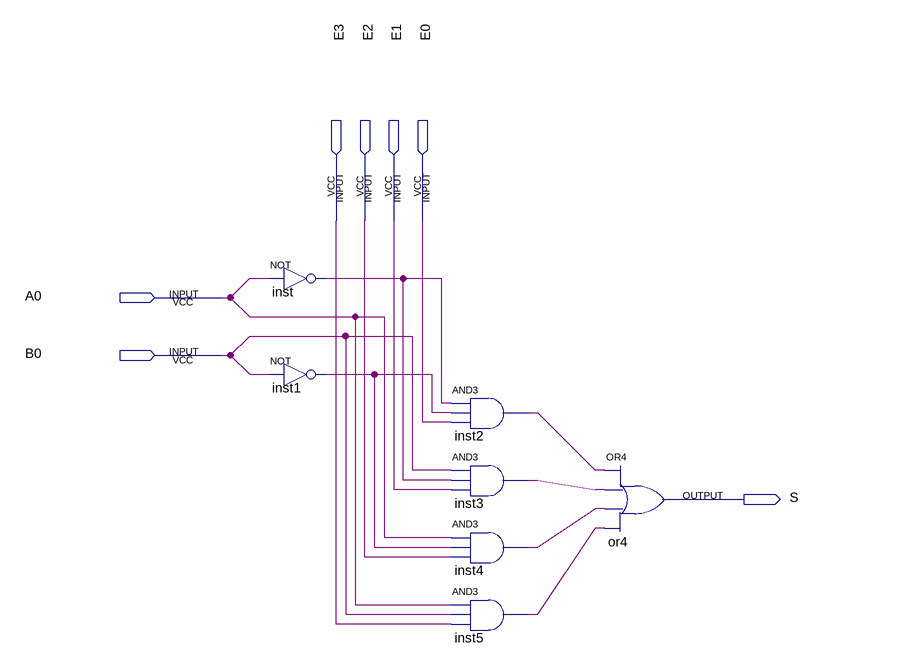
[diagram p0: schematic sheet]
// Quartus schematic mux_41.bdf as structural Verilog: 7 symbols, 7 pins
module mux_41 (
  input  E3,
  input  E2,
  input  E1,
  input  E0,
  input  A0,
  input  B0,
  output S
);

  wire inst1_out, inst2_out, inst3_out, inst4_out, inst5_out, inst_out;

  not inst (inst_out, A0);
  not inst1 (inst1_out, B0);
  and inst2 (inst2_out, inst_out, inst1_out, E0);
  and inst3 (inst3_out, B0, inst_out, E1);
  and inst4 (inst4_out, A0, inst1_out, E2);
  and inst5 (inst5_out, A0, B0, E3);
  or or4 (S, inst2_out, inst3_out, inst4_out, inst5_out);
endmodule
